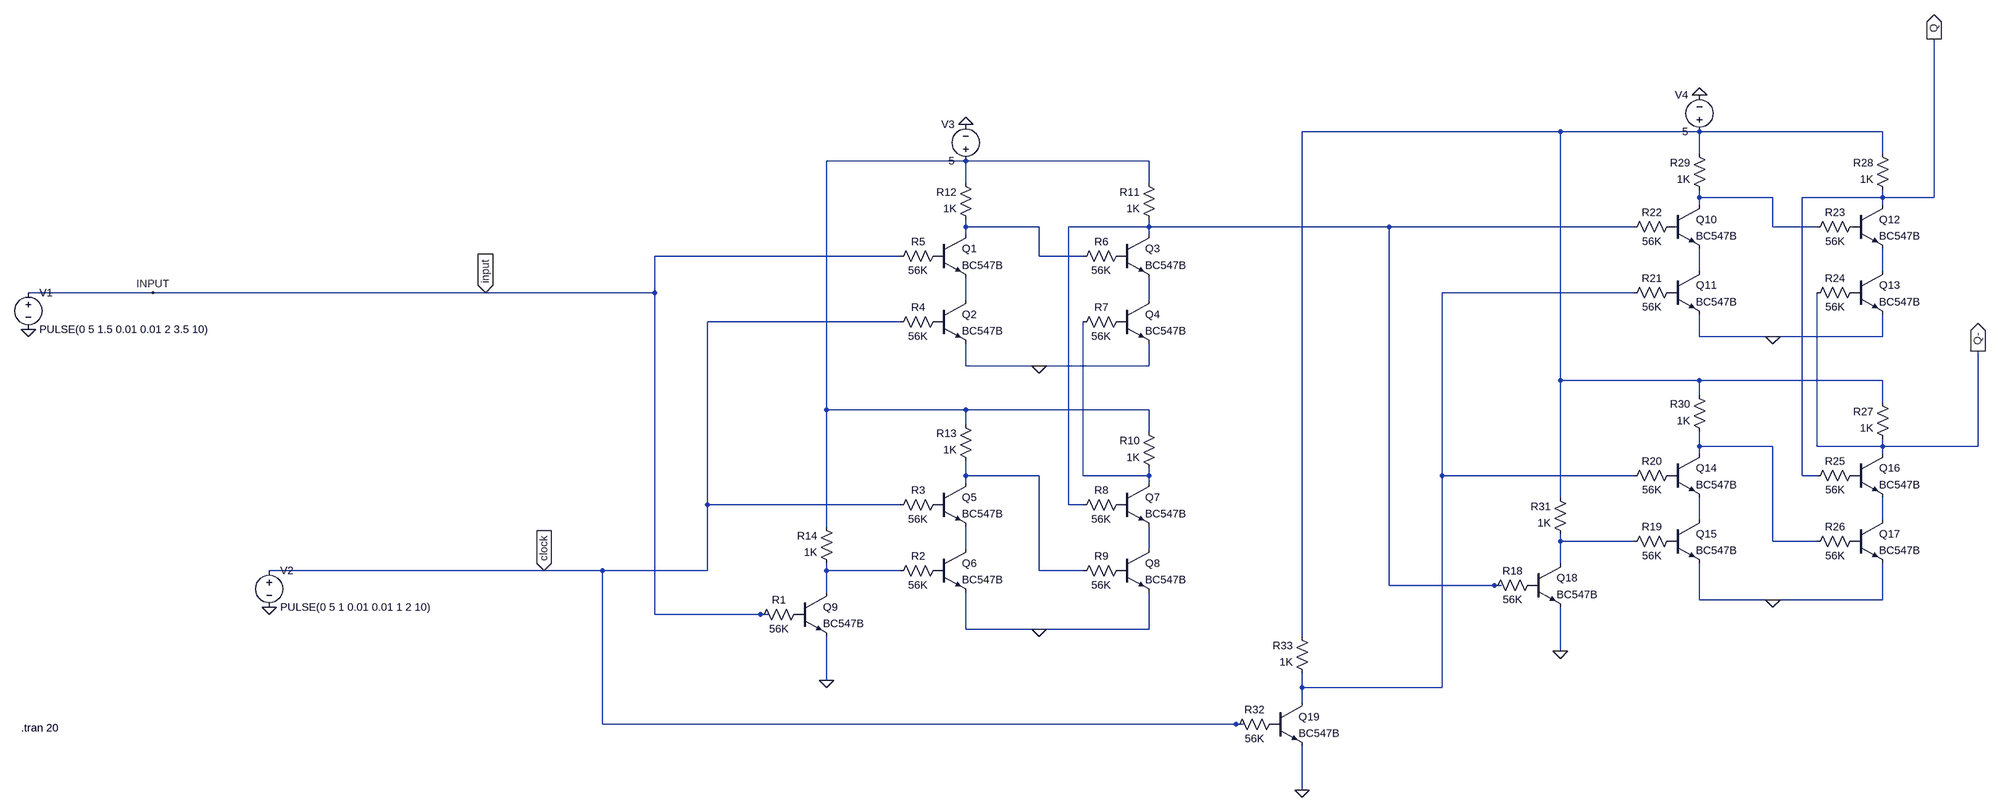
[diagram p0: schematic dflipflop.asc]
dflipflop.asc, the LTspice schematic file:
Version 4
SHEET 1 5768 1172
WIRE 4784 -288 3952 -288
WIRE 5088 -288 4784 -288
WIRE 5488 -288 5088 -288
WIRE 5088 -240 5088 -288
WIRE 5488 -240 5488 -288
WIRE 3136 -224 2832 -224
WIRE 3536 -224 3136 -224
WIRE 3136 -176 3136 -224
WIRE 3536 -176 3536 -224
WIRE 5088 -144 5088 -160
WIRE 5248 -144 5088 -144
WIRE 5488 -144 5488 -160
WIRE 5488 -144 5312 -144
WIRE 5600 -144 5600 -496
WIRE 5600 -144 5488 -144
WIRE 5088 -128 5088 -144
WIRE 5488 -128 5488 -144
WIRE 3136 -80 3136 -96
WIRE 3296 -80 3136 -80
WIRE 3536 -80 3536 -96
WIRE 3536 -80 3360 -80
WIRE 4192 -80 3536 -80
WIRE 4944 -80 4192 -80
WIRE 5248 -80 5248 -144
WIRE 5344 -80 5248 -80
WIRE 3136 -64 3136 -80
WIRE 3536 -64 3536 -80
WIRE 2992 -16 2240 -16
WIRE 3296 -16 3296 -80
WIRE 3392 -16 3296 -16
WIRE 5088 16 5088 -32
WIRE 5488 16 5488 -32
WIRE -992 64 -1264 64
WIRE 304 64 -992 64
WIRE 2240 64 2240 -16
WIRE 2240 64 304 64
WIRE 4944 64 4384 64
WIRE 3136 80 3136 32
WIRE 3536 80 3536 32
WIRE 2992 128 2432 128
WIRE 5088 160 5088 112
WIRE 5248 160 5088 160
WIRE 5488 160 5488 112
WIRE 5488 160 5248 160
WIRE 3136 224 3136 176
WIRE 3296 224 3136 224
WIRE 3536 224 3536 176
WIRE 3536 224 3296 224
WIRE 4784 256 4784 -288
WIRE 5088 256 4784 256
WIRE 5488 256 5088 256
WIRE 5088 288 5088 256
WIRE 5488 304 5488 256
WIRE 2832 320 2832 -224
WIRE 3136 320 2832 320
WIRE 3536 320 3136 320
WIRE 3136 352 3136 320
WIRE 3536 368 3536 320
WIRE 5088 400 5088 368
WIRE 5248 400 5088 400
WIRE 5344 400 5344 64
WIRE 5488 400 5488 384
WIRE 5488 400 5344 400
WIRE 5696 400 5696 192
WIRE 5696 400 5488 400
WIRE 5088 416 5088 400
WIRE 5488 416 5488 400
WIRE 3136 464 3136 432
WIRE 3296 464 3136 464
WIRE 3392 464 3392 128
WIRE 3536 464 3536 448
WIRE 3536 464 3392 464
WIRE 4384 464 4384 64
WIRE 4944 464 4384 464
WIRE 5312 464 5312 -144
WIRE 5344 464 5312 464
WIRE 3136 480 3136 464
WIRE 3536 480 3536 464
WIRE 4784 512 4784 256
WIRE 2432 528 2432 128
WIRE 2992 528 2432 528
WIRE 3360 528 3360 -80
WIRE 3392 528 3360 528
WIRE 5088 560 5088 512
WIRE 5488 560 5488 512
WIRE 2832 576 2832 320
WIRE 4784 608 4784 592
WIRE 4944 608 4784 608
WIRE 5248 608 5248 400
WIRE 5344 608 5248 608
WIRE 3136 624 3136 576
WIRE 3536 624 3536 576
WIRE 4784 656 4784 608
WIRE 432 672 -400 672
WIRE 1088 672 432 672
WIRE 2432 672 2432 528
WIRE 2432 672 1088 672
WIRE 2832 672 2832 656
WIRE 2992 672 2832 672
WIRE 3296 672 3296 464
WIRE 3392 672 3296 672
WIRE 4192 704 4192 -80
WIRE 4640 704 4192 704
WIRE 4656 704 4640 704
WIRE 2832 720 2832 672
WIRE 5088 736 5088 656
WIRE 5248 736 5088 736
WIRE 5488 736 5488 656
WIRE 5488 736 5248 736
WIRE 2240 768 2240 64
WIRE 2688 768 2240 768
WIRE 2704 768 2688 768
WIRE 3136 800 3136 720
WIRE 3296 800 3136 800
WIRE 3536 800 3536 720
WIRE 3536 800 3296 800
WIRE 3952 816 3952 -288
WIRE 4784 848 4784 752
WIRE 2832 912 2832 816
WIRE 3952 928 3952 896
WIRE 4384 928 4384 464
WIRE 4384 928 3952 928
WIRE 3952 960 3952 928
WIRE 1088 1008 1088 672
WIRE 3808 1008 1088 1008
WIRE 3824 1008 3808 1008
WIRE 3952 1152 3952 1056
FLAG 2832 912 0
FLAG 3296 800 0
FLAG 3296 224 0
FLAG -1264 144 0
FLAG 3136 -304 0
FLAG -992 64 INPUT
FLAG 4784 848 0
FLAG 5248 736 0
FLAG 5248 160 0
FLAG 5088 -368 0
FLAG 3952 1152 0
FLAG -400 752 0
FLAG 5600 -496 Q
IOPIN 5600 -496 Out
FLAG 432 672 clock
IOPIN 432 672 In
FLAG 304 64 input
IOPIN 304 64 In
FLAG 5696 192 Q-
IOPIN 5696 192 Out
SYMBOL npn 3072 -64 R0
SYMATTR InstName Q1
SYMATTR Value BC547B
SYMBOL npn 3072 80 R0
SYMATTR InstName Q2
SYMATTR Value BC547B
SYMBOL npn 3472 -64 R0
SYMATTR InstName Q3
SYMATTR Value BC547B
SYMBOL npn 3472 80 R0
SYMATTR InstName Q4
SYMATTR Value BC547B
SYMBOL npn 3072 480 R0
SYMATTR InstName Q5
SYMATTR Value BC547B
SYMBOL npn 3072 624 R0
SYMATTR InstName Q6
SYMATTR Value BC547B
SYMBOL npn 3472 480 R0
SYMATTR InstName Q7
SYMATTR Value BC547B
SYMBOL npn 3472 624 R0
SYMATTR InstName Q8
SYMATTR Value BC547B
SYMBOL npn 2768 720 R0
SYMATTR InstName Q9
SYMATTR Value BC547B
SYMBOL res 2784 752 R90
WINDOW 0 0 56 VBottom 2
WINDOW 3 32 56 VTop 2
SYMATTR InstName R1
SYMATTR Value 56K
SYMBOL res 3088 656 R90
WINDOW 0 0 56 VBottom 2
WINDOW 3 32 56 VTop 2
SYMATTR InstName R2
SYMATTR Value 56K
SYMBOL res 3088 512 R90
WINDOW 0 0 56 VBottom 2
WINDOW 3 32 56 VTop 2
SYMATTR InstName R3
SYMATTR Value 56K
SYMBOL res 3088 112 R90
WINDOW 0 0 56 VBottom 2
WINDOW 3 32 56 VTop 2
SYMATTR InstName R4
SYMATTR Value 56K
SYMBOL res 3088 -32 R90
WINDOW 0 0 56 VBottom 2
WINDOW 3 32 56 VTop 2
SYMATTR InstName R5
SYMATTR Value 56K
SYMBOL res 3488 -32 R90
WINDOW 0 0 56 VBottom 2
WINDOW 3 32 56 VTop 2
SYMATTR InstName R6
SYMATTR Value 56K
SYMBOL res 3488 112 R90
WINDOW 0 0 56 VBottom 2
WINDOW 3 32 56 VTop 2
SYMATTR InstName R7
SYMATTR Value 56K
SYMBOL res 3488 512 R90
WINDOW 0 0 56 VBottom 2
WINDOW 3 32 56 VTop 2
SYMATTR InstName R8
SYMATTR Value 56K
SYMBOL res 3488 656 R90
WINDOW 0 0 56 VBottom 2
WINDOW 3 32 56 VTop 2
SYMATTR InstName R9
SYMATTR Value 56K
SYMBOL res 3552 464 R180
WINDOW 0 36 76 Left 2
WINDOW 3 36 40 Left 2
SYMATTR InstName R10
SYMATTR Value 1K
SYMBOL res 3552 -80 R180
WINDOW 0 36 76 Left 2
WINDOW 3 36 40 Left 2
SYMATTR InstName R11
SYMATTR Value 1K
SYMBOL res 3152 -80 R180
WINDOW 0 36 76 Left 2
WINDOW 3 36 40 Left 2
SYMATTR InstName R12
SYMATTR Value 1K
SYMBOL res 3152 448 R180
WINDOW 0 36 76 Left 2
WINDOW 3 36 40 Left 2
SYMATTR InstName R13
SYMATTR Value 1K
SYMBOL res 2848 672 R180
WINDOW 0 36 76 Left 2
WINDOW 3 36 40 Left 2
SYMATTR InstName R14
SYMATTR Value 1K
SYMBOL voltage -1264 48 R0
WINDOW 123 0 0 Left 0
WINDOW 39 0 0 Left 0
SYMATTR InstName V1
SYMATTR Value PULSE(0 5 1.5 0.01 0.01 2 3.5 10)
SYMBOL voltage 3136 -208 R180
WINDOW 0 24 96 Left 2
WINDOW 3 24 16 Left 2
WINDOW 123 0 0 Left 0
WINDOW 39 0 0 Left 0
SYMATTR InstName V3
SYMATTR Value 5
SYMBOL npn 5024 -128 R0
SYMATTR InstName Q10
SYMATTR Value BC547B
SYMBOL npn 5024 16 R0
SYMATTR InstName Q11
SYMATTR Value BC547B
SYMBOL npn 5424 -128 R0
SYMATTR InstName Q12
SYMATTR Value BC547B
SYMBOL npn 5424 16 R0
SYMATTR InstName Q13
SYMATTR Value BC547B
SYMBOL npn 5024 416 R0
SYMATTR InstName Q14
SYMATTR Value BC547B
SYMBOL npn 5024 560 R0
SYMATTR InstName Q15
SYMATTR Value BC547B
SYMBOL npn 5424 416 R0
SYMATTR InstName Q16
SYMATTR Value BC547B
SYMBOL npn 5424 560 R0
SYMATTR InstName Q17
SYMATTR Value BC547B
SYMBOL npn 4720 656 R0
SYMATTR InstName Q18
SYMATTR Value BC547B
SYMBOL res 4736 688 R90
WINDOW 0 0 56 VBottom 2
WINDOW 3 32 56 VTop 2
SYMATTR InstName R18
SYMATTR Value 56K
SYMBOL res 5040 592 R90
WINDOW 0 0 56 VBottom 2
WINDOW 3 32 56 VTop 2
SYMATTR InstName R19
SYMATTR Value 56K
SYMBOL res 5040 448 R90
WINDOW 0 0 56 VBottom 2
WINDOW 3 32 56 VTop 2
SYMATTR InstName R20
SYMATTR Value 56K
SYMBOL res 5040 48 R90
WINDOW 0 0 56 VBottom 2
WINDOW 3 32 56 VTop 2
SYMATTR InstName R21
SYMATTR Value 56K
SYMBOL res 5040 -96 R90
WINDOW 0 0 56 VBottom 2
WINDOW 3 32 56 VTop 2
SYMATTR InstName R22
SYMATTR Value 56K
SYMBOL res 5440 -96 R90
WINDOW 0 0 56 VBottom 2
WINDOW 3 32 56 VTop 2
SYMATTR InstName R23
SYMATTR Value 56K
SYMBOL res 5440 48 R90
WINDOW 0 0 56 VBottom 2
WINDOW 3 32 56 VTop 2
SYMATTR InstName R24
SYMATTR Value 56K
SYMBOL res 5440 448 R90
WINDOW 0 0 56 VBottom 2
WINDOW 3 32 56 VTop 2
SYMATTR InstName R25
SYMATTR Value 56K
SYMBOL res 5440 592 R90
WINDOW 0 0 56 VBottom 2
WINDOW 3 32 56 VTop 2
SYMATTR InstName R26
SYMATTR Value 56K
SYMBOL res 5504 400 R180
WINDOW 0 36 76 Left 2
WINDOW 3 36 40 Left 2
SYMATTR InstName R27
SYMATTR Value 1K
SYMBOL res 5504 -144 R180
WINDOW 0 36 76 Left 2
WINDOW 3 36 40 Left 2
SYMATTR InstName R28
SYMATTR Value 1K
SYMBOL res 5104 -144 R180
WINDOW 0 36 76 Left 2
WINDOW 3 36 40 Left 2
SYMATTR InstName R29
SYMATTR Value 1K
SYMBOL res 5104 384 R180
WINDOW 0 36 76 Left 2
WINDOW 3 36 40 Left 2
SYMATTR InstName R30
SYMATTR Value 1K
SYMBOL res 4800 608 R180
WINDOW 0 36 76 Left 2
WINDOW 3 36 40 Left 2
SYMATTR InstName R31
SYMATTR Value 1K
SYMBOL voltage 5088 -272 R180
WINDOW 0 24 96 Left 2
WINDOW 3 24 16 Left 2
WINDOW 123 0 0 Left 0
WINDOW 39 0 0 Left 0
SYMATTR InstName V4
SYMATTR Value 5
SYMBOL npn 3888 960 R0
SYMATTR InstName Q19
SYMATTR Value BC547B
SYMBOL res 3904 992 R90
WINDOW 0 0 56 VBottom 2
WINDOW 3 32 56 VTop 2
SYMATTR InstName R32
SYMATTR Value 56K
SYMBOL res 3968 912 R180
WINDOW 0 36 76 Left 2
WINDOW 3 36 40 Left 2
SYMATTR InstName R33
SYMATTR Value 1K
SYMBOL voltage -400 656 R0
WINDOW 123 0 0 Left 0
WINDOW 39 0 0 Left 0
SYMATTR InstName V2
SYMATTR Value PULSE(0 5 1 0.01 0.01 1 2 10)
TEXT -1280 1016 Left 2 !.tran 20

The netlist it stands for:
* dflipflop.asc
Q1 N004 P001 N009 0 BC547B
Q2 N009 P002 0 0 BC547B
Q3 N005 P003 N010 0 BC547B
Q4 N010 P004 0 0 BC547B
Q5 N012 P005 N017 0 BC547B
Q6 N017 P006 0 0 BC547B
Q7 N013 P007 N018 0 BC547B
Q8 N018 P008 0 0 BC547B
Q9 N019 P009 0 0 BC547B
R1 P009 INPUT 56K
R2 P006 N019 56K
R3 P005 clock 56K
R4 P002 clock 56K
R5 P001 INPUT 56K
R6 P003 N004 56K
R7 P004 N013 56K
R8 P007 N005 56K
R9 P008 N012 56K
R10 N013 N002 1K
R11 N005 N002 1K
R12 N004 N002 1K
R13 N012 N002 1K
R14 N019 N002 1K
V1 INPUT 0 PULSE(0 5 1.5 0.01 0.01 2 3.5 10)
V3 N002 0 5
Q10 N003 P010 N006 0 BC547B
Q11 N006 P011 0 0 BC547B
Q12 Q P012 N007 0 BC547B
Q13 N007 P013 0 0 BC547B
Q14 N011 P014 N014 0 BC547B
Q15 N014 P015 0 0 BC547B
Q16 Q- P016 N015 0 BC547B
Q17 N015 P017 0 0 BC547B
Q18 N016 P018 0 0 BC547B
R18 P018 N005 56K
R19 P015 N016 56K
R20 P014 N008 56K
R21 P011 N008 56K
R22 P010 N005 56K
R23 P012 N003 56K
R24 P013 Q- 56K
R25 P016 Q 56K
R26 P017 N011 56K
R27 Q- N001 1K
R28 Q N001 1K
R29 N003 N001 1K
R30 N011 N001 1K
R31 N016 N001 1K
V4 N001 0 5
Q19 N008 P019 0 0 BC547B
R32 P019 clock 56K
R33 N008 N001 1K
V2 clock 0 PULSE(0 5 1 0.01 0.01 1 2 10)
.model NPN NPN
.model PNP PNP
.lib standard.bjt
.tran 20
.backanno
.end